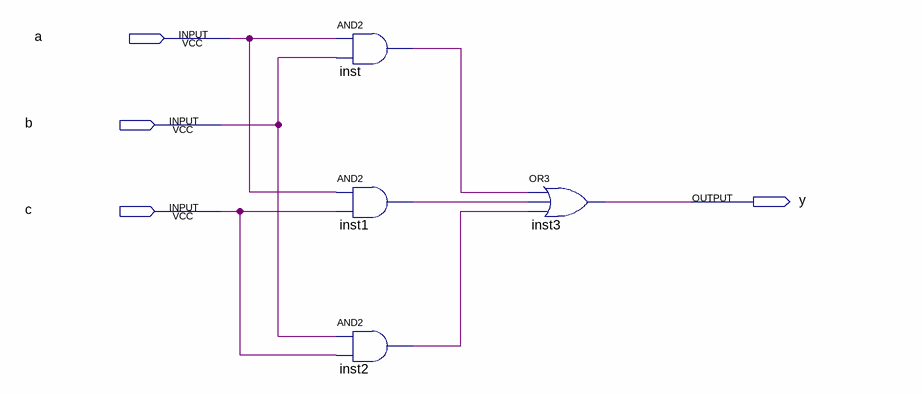
[diagram p0: schematic sheet]
// Quartus schematic three.bdf as structural Verilog: 4 symbols, 4 pins
module three (
  input  a,
  input  b,
  input  c,
  output y
);

  wire inst1_out, inst2_out, inst_out;

  and inst (inst_out, a, b);
  and inst1 (inst1_out, a, c);
  and inst2 (inst2_out, b, c);
  or inst3 (y, inst_out, inst1_out, inst2_out);
endmodule
